# EAGLE design ESP-WROOM32-Breakout_v11 (EAGLE 7.7.0)
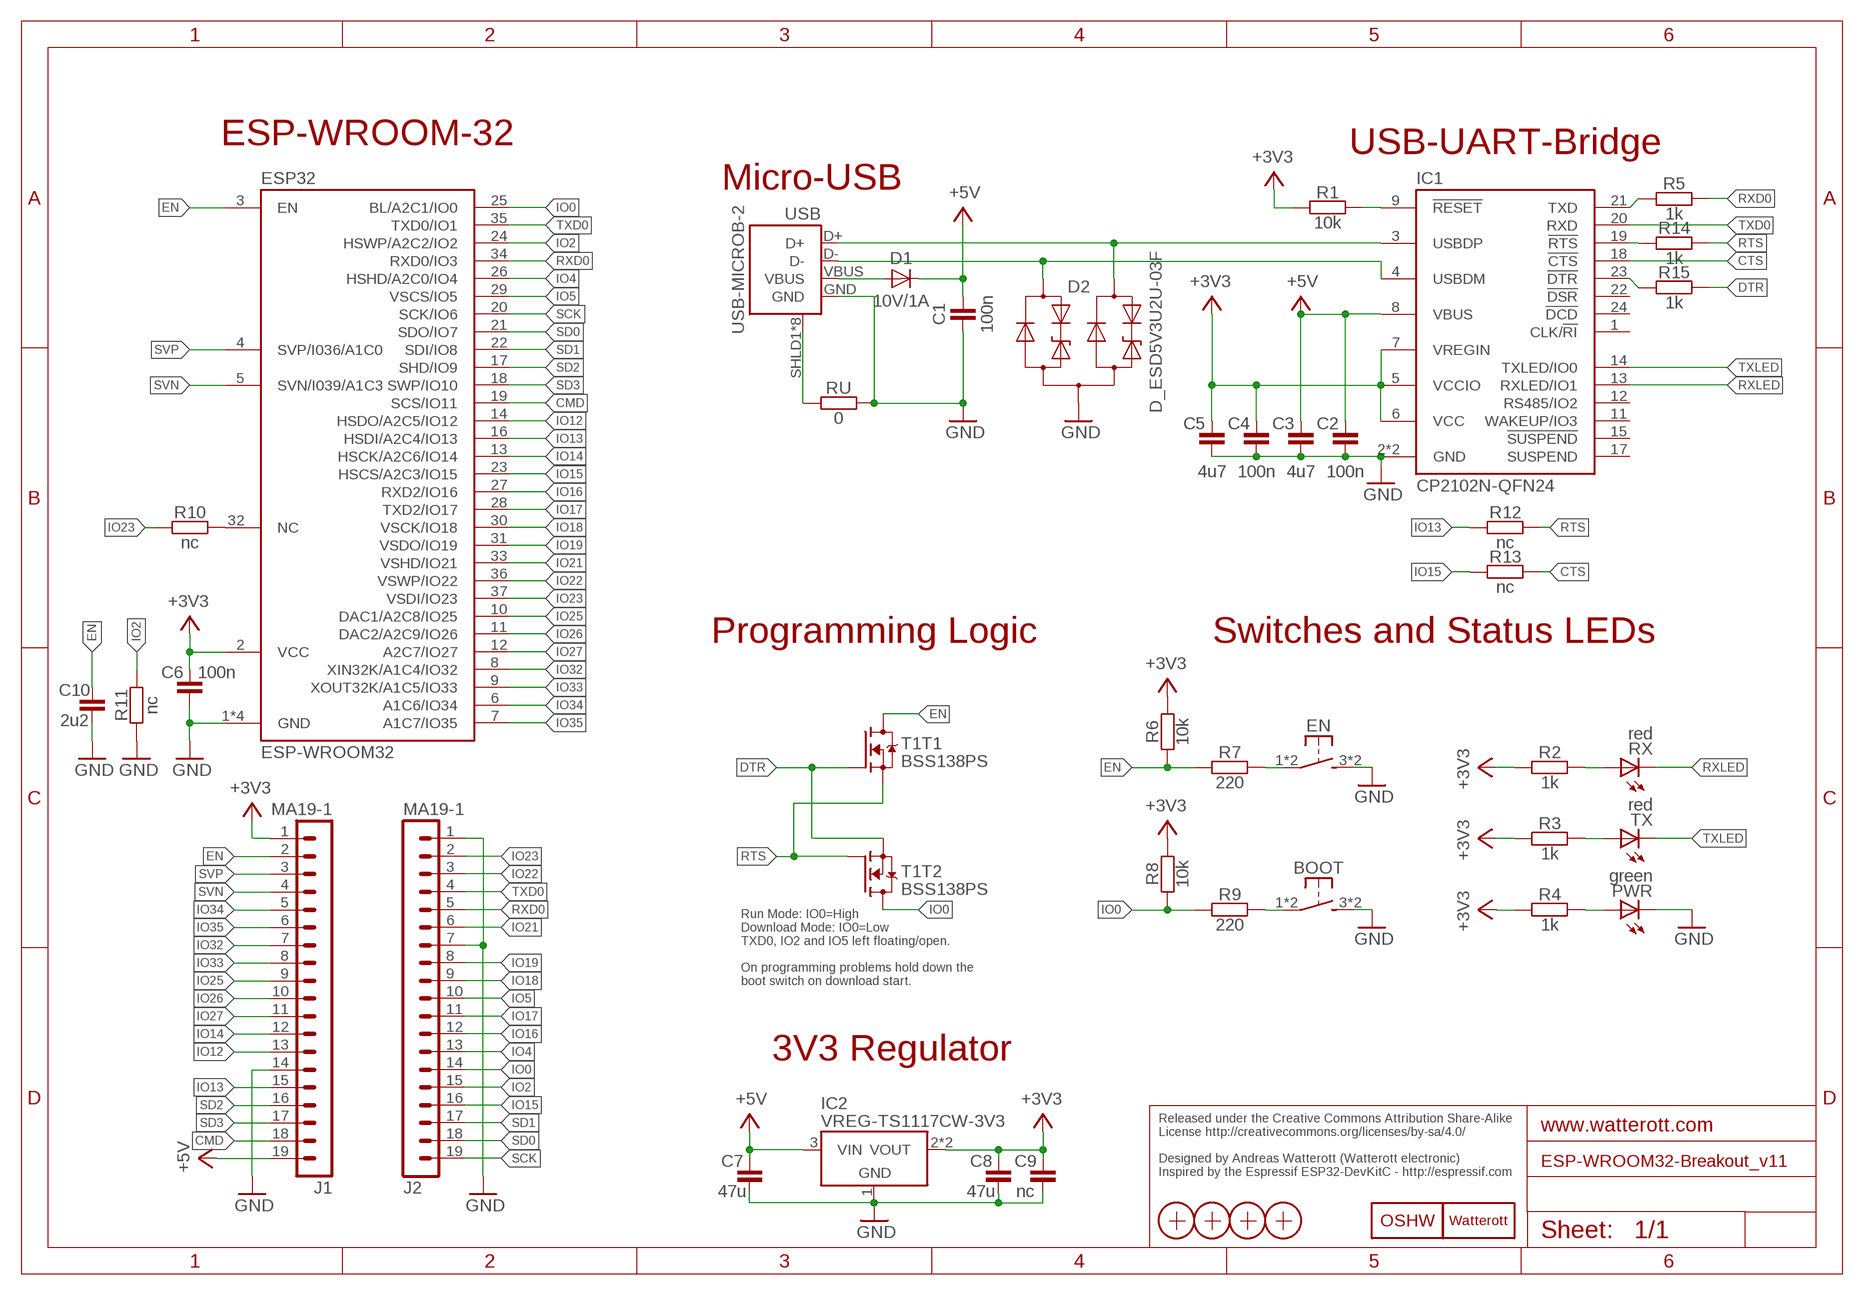
[diagram p0: schematic, sheet 1]

## Parts
BOOT  SW-TACTILE-PTS840P  [PTS840P]
C1  100n  CAPACITOR-0402  [C0402]
C2  100n  CAPACITOR-0402  [C0402]
C3  4u7  CAPACITOR-0603  [C0603]
C4  100n  CAPACITOR-0402  [C0402]
C5  4u7  CAPACITOR-0603  [C0603]
C6  100n  CAPACITOR-0402  [C0402]
C7  47u  CAPACITOR-1206  [C1206]
C8  47u  CAPACITOR-1206  [C1206]
C9  nc  CAPACITOR-1206  [C1206]
C10  2u2  CAPACITOR-0402  [C0402]
D1  10V/1A  DIODE-SMA  [SMA_DO214AC]
D2  D_ESD5V3U2U-03F  [SOT723]
EN  SW-TACTILE-PTS840P  [PTS840P]
ESP32  ESP-WROOM32  [ESP-WROOM32]
IC1  CP2102N-QFN24  [QFN24-PAD]
IC2  VREG-TS1117CW-3V3  [SOT223]
J1  MA19-1  [MA19-1]
J2  MA19-1  [MA19-1]
LOGO2  OSHW_LOGOX0070  [OSHW_6X70]
LOGO4  LOGO-S_PLACE_M  [SPARK_TPLACE_M]
PWR  green  LED-0603  [C0603]
R1  10k  RESISTOR-0402  [C0402]
R2  1k  RESISTOR-0402  [C0402]
R3  1k  RESISTOR-0402  [C0402]
R4  1k  RESISTOR-0402  [C0402]
R5  1k  RESISTOR-0402  [C0402]
R6  10k  RESISTOR-0402  [C0402]
R7  220  RESISTOR-0402  [C0402]
R8  10k  RESISTOR-0402  [C0402]
R9  220  RESISTOR-0402  [C0402]
R10  nc  RESISTOR-0402  [C0402]
R11  nc  RESISTOR-0402  [C0402]
R12  nc  RESISTOR-0402  [C0402]
R13  nc  RESISTOR-0402  [C0402]
R14  1k  RESISTOR-0402  [C0402]
R15  1k  RESISTOR-0402  [C0402]
RU  0  RESISTOR-0402  [C0402]
RX  red  LED-0603  [C0603]
T1  BSS138PS  [SOT363]
TX  red  LED-0603  [C0603]
USB  USB-MICROB-2  [USB-MICROB-10118194]
X1  PASSER-07  [PASSER_07MM]
X2  PASSER-07  [PASSER_07MM]
X3  PASSER-07  [PASSER_07MM]
X4  PASSER-07  [PASSER_07MM]

## Nets
+3V3: C4.2 C5.2 C6.2 C8.2 C9.2 ESP32.2(VCC) IC1.5(VCCIO) IC1.6(VCC) IC1.7(VREGIN) IC2.2(VOUT) IC2.4(VOUT) J1.1 R1.1 R2.1 R3.1 R4.1 R6.2 R8.2
+5V: C1.2 C2.2 C3.2 C7.2 D1.C IC1.8(VBUS) IC2.3(VIN) J1.19
CMD: ESP32.19(SCS/IO11) J1.18
CPDTR: IC1.23(!DTR) R15.1
CPRTS: IC1.19(!RTS) R14.1
CPTX: IC1.21(TXD) R5.1
CTS: IC1.18(!CTS) R13.2
D_N: D2.1(C1) IC1.4(USBDM) USB.D-
D_P: D2.2(C2) IC1.3(USBDP) USB.D+
DTR: R15.2 T1.2(T1:G) T1.4(T2:S)
EN: C10.2 ESP32.3(EN) J1.2 R6.1 R7.1 T1.6(T1:D)
GND: BOOT.3(S1) BOOT.4(S1) C1.1 C2.1 C3.1 C4.1 C5.1 C6.1 C7.1 C8.1 C9.1 C10.1 D2.3(A) EN.3(S1) EN.4(S1) ESP32.1(GND) ESP32.15(GND) ESP32.38(GND) ESP32.TP(GND) IC1.2(GND) IC1.TP(GND) IC2.1(GND) J1.14 J2.1 J2.7 PWR.C R11.1 RU.2 USB.GND
IO0: ESP32.25(BL/A2C1/IO0) J2.14 R8.1 R9.1 T1.3(T2:D)
IO2: ESP32.24(HSWP/A2C2/IO2) J2.15 R11.2
IO4: ESP32.26(HSHD/A2C0/IO4) J2.13
IO5: ESP32.29(VSCS/IO5) J2.10
IO12: ESP32.14(HSDO/A2C5/IO12) J1.13
IO13: ESP32.16(HSDI/A2C4/IO13) J1.15 R12.1
IO14: ESP32.13(HSCK/A2C6/IO14) J1.12
IO15: ESP32.23(HSCS/A2C3/IO15) J2.16 R13.1
IO16: ESP32.27(RXD2/IO16) J2.12
IO17: ESP32.28(TXD2/IO17) J2.11
IO18: ESP32.30(VSCK/IO18) J2.9
IO19: ESP32.31(VSDO/IO19) J2.8
IO21: ESP32.33(VSHD/IO21) J2.6
IO22: ESP32.36(VSWP/IO22) J2.3
IO23: ESP32.37(VSDI/IO23) J2.2 R10.1
IO25: ESP32.10(DAC1/A2C8/IO25) J1.9
IO26: ESP32.11(DAC2/A2C9/IO26) J1.10
IO27: ESP32.12(A2C7/IO27) J1.11
IO32: ESP32.8(XIN32K/A1C4/IO32) J1.7
IO33: ESP32.9(XOUT32K/A1C5/IO33) J1.8
IO34: ESP32.6(A1C6/IO34) J1.5
IO35: ESP32.7(A1C7/IO35) J1.6
N$1: EN.1 EN.2(P1) R7.2
N$2: BOOT.1 BOOT.2(P1) R9.2
NC: ESP32.32(NC) R10.2
PWR-LED: PWR.A R4.2
RESET: IC1.9(!RESET) R1.2
RTS: R12.2 R14.2 T1.1(T1:S) T1.5(T2:G)
RX-LED: R2.2 RX.A
RXD0: ESP32.34(RXD0/IO3) J2.5 R5.2
RXLED: IC1.13(RXLED/IO1) RX.C
SCK: ESP32.20(SCK/IO6) J2.19
SD0: ESP32.21(SDO/IO7) J2.18
SD1: ESP32.22(SDI/IO8) J2.17
SD2: ESP32.17(SHD/IO9) J1.16
SD3: ESP32.18(SWP/IO10) J1.17
SHLD: RU.1 USB.SHLD1(SHIELD) USB.SHLD2(SHIELD) USB.SHLD3(SHIELD) USB.SHLD4(SHIELD) USB.SHLD5(SHIELD) USB.SHLD6(SHIELD) USB.SHLD7(SHIELD) USB.SHLD8(SHIELD)
SVN: ESP32.5(SVN/I039/A1C3) J1.4
SVP: ESP32.4(SVP/I036/A1C0) J1.3
TX-LED: R3.2 TX.A
TXD0: ESP32.35(TXD0/IO1) IC1.20(RXD) J2.4
TXLED: IC1.14(TXLED/IO0) TX.C
VBUS: D1.A USB.VBUS
Unconnected: IC1.1(CLK/!RI) IC1.11(WAKEUP/IO3) IC1.12(RS485/IO2) IC1.15(!SUSPEND) IC1.17(SUSPEND) IC1.22(!DSR) IC1.24(!DCD)

## Notes on the sheet
- ESP-WROOM-32 | USB-UART-Bridge
- Micro-USB
- Programming Logic | Switches and Status LEDs
- Run Mode: IO0=High
  Download Mode: IO0=Low
  TXD0, IO2 and IO5 left floating/open.
  
  On programming problems hold down the 
  boot switch on download start.
- 3V3 Regulator
- Released under the Creative Commons Attribution Share-Alike
  License http://creativecommons.org/licenses/by-sa/4.0/
  
  Designed by Andreas Watterott (Watterott electronic)
  Inspired by the Espressif ESP32-DevKitC - http://espressif.com

## Library data of the parts
BOOT EN = we-switch:SW-TACTILE: Tactile Switches; DIGIKEY: CKN10511DKR-ND
C1-C10 = we-rcl:CAPACITOR: Capacitors ...2.2uF @ 6.3V -> 0402 ...4.7uF @ 6.3V -> 0603 ...10uF @ 16V -> 0805 ...22uF @ 25V -> 1206
D1 = we-rcl:DIODE: Diodes
D2 = we-rcl:D_ESD5V3U2U: TVS Diode - Uni-directional Ultra Low ESD / Transient Protection Diode Vrwm=5.3V, 0.4pF@1MHz; DIGIKEY: ESD5V3U2U-03F H6327DKR-ND
ESP32 = we-chip:ESP-WROOM32: Espressif ESP-WROOM-32 ESP32 WiFi/WLAN + Bluetooth/BLE Module Compatible with AI-Thinker ESP-32S Module.
IC1 = we-chip:CP2102N: Silabs CP2102N USB to UART Bridge (5V tolerant inputs) CP2102N-QFN24 is pin-compatible with CP2104.
IC2 = we-power:VREG: Voltage Regulators (LDOs, Switching Converters...) LDOs Taiwan Semi TS1117 800mA max 15V - compatible On Semi NCP1117 1A max 20V Taiwan Semi TS9011 250mA max 12V - compatible Diodes AP2210 300mA max 15V - compatible Microchip MCP1702 250mA max 13V - compatible Microchip MCP1703 250mA max 16V - compatible Microchip MCP1754 150mA max 16V Taiwan Semi TS5204 150mA max 16V (low noise) DC/DC Converter Modules Recom R-78Ex.x-1.0-W36 1A max 28V Murata OKI-78SR-x.x/1.5-W36 1.5A max 36V CUI V78xx-2000 2A max 18V
J1 J2 = we-con:MA19-1: Pin Header
LOGO2 = we-symbol:OSHW_LOGO: Open-Source-Hardware Logo
LOGO4 = we-symbol:LOGO: Watterott electronic Logo
PWR RX TX = we-opto:LED: LEDs red, green, blue -> 0603
R1-R15 RU = we-rcl:RESISTOR: Resistors all kinds in 0402 and 0603
T1 = we-transistor:BSS138PS: Dual N-Channel MOSFET BSS138 (Vgs>=+/-20V, Vds>=40V, Id>=0.2A + Rds<=3Ohm @ Vgs=4.5V)
USB = we-con:USB: USB Connectors; DIGIKEY: 609-4618-6-ND
X1-X4 = we-symbol:PASSER: Fiducial Markers

## Board
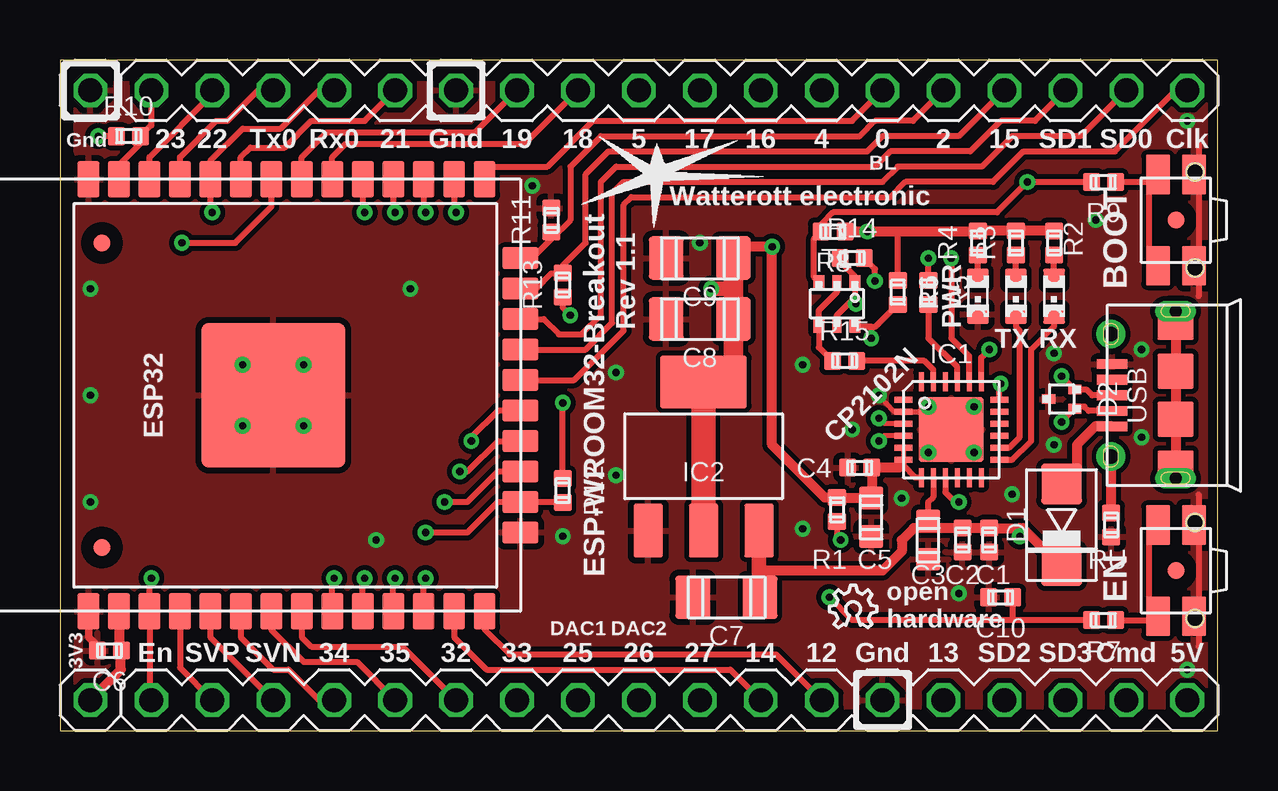
[diagram p1: board, top side]
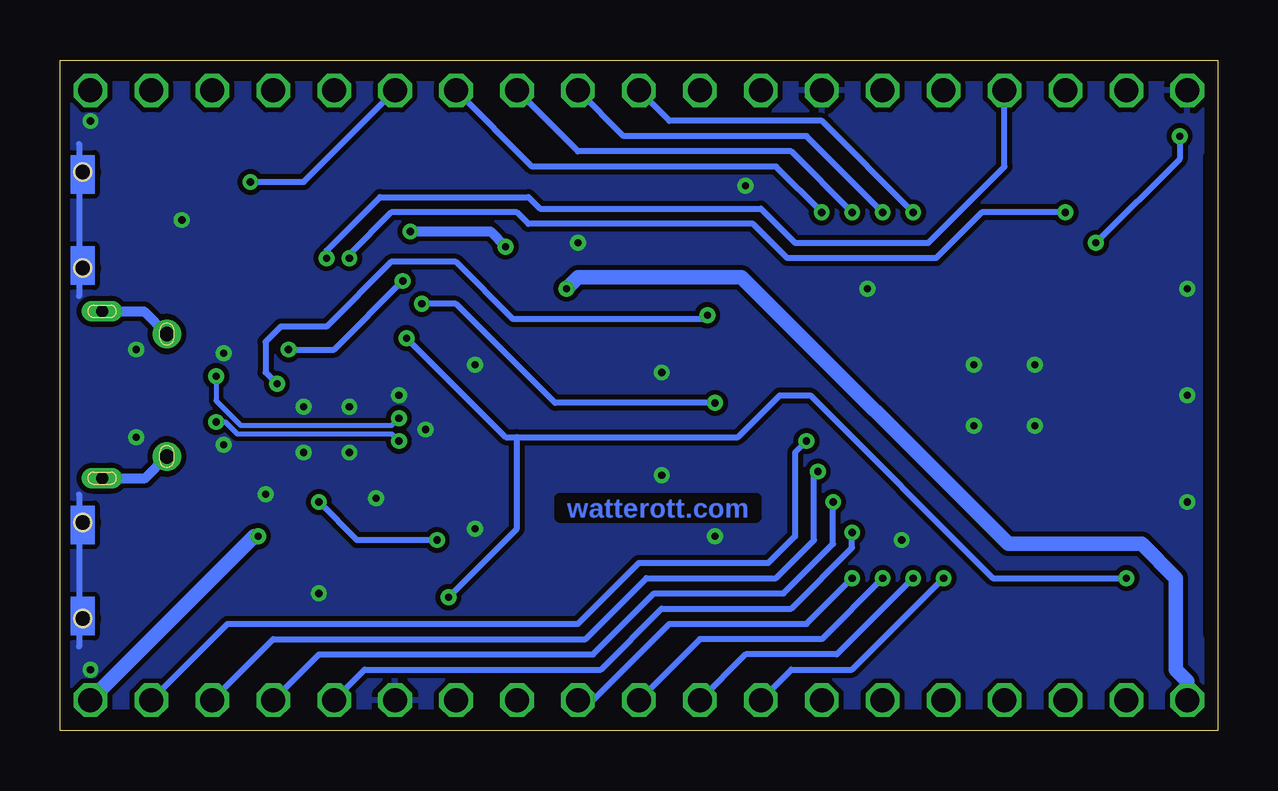
[diagram p2: board, bottom side, seen from below]

Size 48.26 x 27.94 mm. Coordinates in mm from the lower left corner, seen from the top.
Outline: 0,0 48.26,0 48.26,27.94 0,27.94 0,0
Copper layers (1*16): Top 0.035mm / dielectric 1.5mm / Bottom 0.035mm
Design rules "we-dru-2-layer *": minimum track width 0.15mm, minimum drill 0.3mm, track to track 0.15mm, track to pad 0.15mm, pad to pad 0.15mm, via to via 0.15mm, smd to smd 0.1mm, copper to edge 0.4mm, drill to drill 0.2mm, minimum pad ring 0.18mm, minimum via ring 0.18mm, stop-mask expansion 0.1mm, vias tented up to drill 0.5mm, thermal gap 0.25mm

### Footprints (pad centres in the part's own frame; a part is rotated, then mirrored left to right if it is on the bottom)
PTS840P = smd 1.65 x 1: 1 -1.9,0.75; 2 1.9,0.75; 3 -1.9,-0.75; 4 1.9,-0.75 | hole 0.7: -2,-0.8; 2,-0.8
C0402 = smd 0.75 x 0.7: 1 0,0.5; 2 0,-0.5
C0603 = smd 1 x 0.95: 1 0,0.8; 2 0,-0.8
C1206 = smd 1.8 x 1.45: 1 0,1.4; 2 0,-1.4
SMA_DO214AC = smd 1.7 x 1.7: A 0,-1.7; C 0,1.7
SOT723 = smd 0.6 x 0.4: 1 -0.55,0.4; 2 -0.55,-0.4; 3 0.55,0
ESP-WROOM32 = smd 1.5 x 0.9: 1 -9,7; 2 -9,5.73; 3 -9,4.46; 4 -9,3.19; 5 -9,1.92; 6 -9,0.65; 7 -9,-0.62; 8 -9,-1.89; 9 -9,-3.16; 10 -9,-4.43; 11 -9,-5.7; 12 -9,-6.97; 13 -9,-8.24; 14 -9,-9.51; 25 9,-9.51; 26 9,-8.24; 27 9,-6.97; 28 9,-5.7; 29 9,-4.43; 30 9,-3.16; 31 9,-1.89; 32 9,-0.62; 33 9,0.65; 34 9,1.92; 35 9,3.19; 36 9,4.46; 37 9,5.73; 38 9,7 | smd 0.9 x 1.5: 15 -5.715,-11; 16 -4.445,-11; 17 -3.175,-11; 18 -1.905,-11; 19 -0.635,-11; 20 0.635,-11; 21 1.905,-11; 22 3.175,-11; 23 4.445,-11; 24 5.715,-11 | smd 6 x 6: TP 0,-0.7
QFN24-PAD = smd 0.8 x 0.26: 1 -2,1.25; 2 -2,0.75; 3 -2,0.25; 4 -2,-0.25; 5 -2,-0.75; 6 -2,-1.25; 13 2,-1.25; 14 2,-0.75; 15 2,-0.25; 16 2,0.25; 17 2,0.75; 18 2,1.25 | smd 0.26 x 0.8: 7 -1.25,-2; 8 -0.75,-2; 9 -0.25,-2; 10 0.25,-2; 11 0.75,-2; 12 1.25,-2; 19 1.25,2; 20 0.75,2; 21 0.25,2; 22 -0.25,2; 23 -0.75,2; 24 -1.25,2 | smd 2.7 x 2.7: TP 0,0
SOT223 = smd 2.235 x 1.219: 1 -3.099,2.311; 2 -3.099,0; 3 -3.099,-2.311 | smd 2.2 x 3.6: 4 3.099,0
MA19-1 = drill 1 octagon: 1 0,22.86; 2 0,20.32; 3 0,17.78; 4 0,15.24; 5 0,12.7; 6 0,10.16; 7 0,7.62; 8 0,5.08; 9 0,2.54; 10 0,0; 11 0,-2.54; 12 0,-5.08; 13 0,-7.62; 14 0,-10.16; 15 0,-12.7; 16 0,-15.24; 17 0,-17.78; 18 0,-20.32; 19 0,-22.86
C0603' = smd 0.9 x 0.8: A 0,-0.75; C 0,0.75
SOT363 = smd 0.6 x 0.5: 1 -0.9,0.75; 3 -0.9,-0.75; 4 0.9,-0.75; 6 0.9,0.75 | smd 0.6 x 0.4: 2 -0.9,0; 5 0.9,0
USB-MICROB-10118194 = smd 1.3 x 0.4: D+ -2.5,0; D- -2.5,-0.65; GND -2.5,1.3; ID -2.5,0.65; VBUS -2.5,-1.3 | drill 0.6 pad 1.2: SHLD1 -2.55,2.55; SHLD2 -2.55,-2.55 | drill 0.5 pad 0.8 long: SHLD3 0.15,3.5; SHLD4 0.15,-3.45 | smd 1.5 x 1.1: SHLD5 0.15,2.85; SHLD6 0.15,-2.85 | smd 1.5 x 1.5: SHLD7 0.15,1; SHLD8 0.15,-1
PASSER_07MM = smd 0.7 x 0.7: X 0,0

### Placement (x,y rotation side)
BOOT  46.51,21.27 90 top
C1  38.73,7.94 180 top
C2  37.62,7.94 180 top
C3  36.2,7.94 180 top
C4  33.34,10.95 90 top
C5  33.81,8.89 180 top
C6  2.06,3.33 90 top
C7  27.78,5.56 90 top
C8  26.67,17.14 90 top
C9  26.67,19.68 90 top
C10  39.21,5.56 90 top
D1  41.75,8.57 180 top
D2  41.75,13.81 180 top
EN  46.51,6.67 90 top
ESP32  8.19,13.97 90 top
IC1  37.15,12.54 0 top
IC2  26.83,11.43 90 top
J1  24.13,1.27 90 top
J2  24.13,26.67 90 top
LOGO2  32.07,4.29 0 top
LOGO4  24.92,23.18 0 top
PWR  green  [C0603']  38.26,18.1 180 top
R1  32.38,9.21 0 top
R2  41.43,20.32 0 top
R3  39.85,20.32 0 top
R4  38.26,20.32 0 top
R5  36.2,18.26 180 top
R6  34.92,18.26 180 top
R7  43.5,4.6 90 top
R8  32.23,20.8 90 top
R9  43.5,22.86 90 top
R10  2.86,24.77 270 top
R11  20.48,21.27 0 top
R12  20.95,10 180 top
R13  20.95,18.57 0 top
R14  33.02,19.68 270 top
R15  32.7,15.4 270 top
RU  43.81,8.57 0 top
RX  red  [C0603']  41.43,18.1 180 top
T1  32.38,17.78 270 top
TX  red  [C0603']  39.85,18.1 180 top
USB  46.35,13.97 0 top
X1  1.75,20.32 180 top
X2  1.75,7.62 180 top
X3  46.51,21.27 0 top
X4  46.51,6.67 0 top

### Tracks (layer width: path | path; a pad name or v marks a point on that pad's centre or on a via)
+3V3  (via drill 0.3)
  Top 0.203: 33.84,9.71 C5.2 33.8,9.71 | IC1.5 IC1.6
  Top 0.254: 34.95,11.29 IC1.6 35.15,11.11 | IC1.7 35.66,10.54 35.15,11.05 35.15,11.11 | 34.99,10.95 35.15,11.11 | C9.2 28.07,19.71 27.94,19.84 | R6.2 34.92,20.8
  Top 0.406: R2.1 R3.1 R4.1 38.23,20.8 34.92,20.8 v33.66,20.8 R8.2 | 34.99,10.95 C4.2 33.84,9.71 | 33.8,9.71 R1.1 31.89,9.71 29.69,11.91 v29.69,20.16 28.26,20.16 27.94,19.84 | ESP32.2 2.46,3.44 C6.2 2.54,3.31 2.54,2.54 J1.1
  Top 0.61: 28.07,14.89 27.78,14.61 26.91,14.61 IC2.4 | v27.15,18.41 28.07,18.41
  Top 0.813: C9.2 28.07,18.41 C8.2 28.07,14.89
  Top 1.016: IC2.2 IC2.4
  Bottom 0.406: v33.66,20.8 30.32,20.8 v29.69,20.16
  Bottom 0.61: v27.15,18.41 26.67,18.89 19.84,18.89 8.73,7.78 3.17,7.78 1.75,6.35 1.75,2.54 1.27,2.06 J1.1
+5V  (via drill 0.3)
  Top 0.254: D1.C 41.7,6.87 | IC1.8 36.4,9.73 36.2,9.53 C3.2
  Top 0.406: 40.01,8.44 C1.2 C2.2 36.2,8.44 | 40.01,8.44 40.14,8.44 41.7,6.87 | v40.01,8.1 40.01,8.44 | 29.14,6.67 34.29,6.67 35.08,7.46 35.08,7.94 35.58,8.44 36.2,8.44 | C3.2 36.2,8.44
  Top 0.61: IC2.3 29.14,6.67 29.14,5.6 C7.2
  Bottom 0.61: J1.19 40.16,8.1 v40.01,8.1
CMD  (via drill 0.3)
  Top 0.254: ESP32.19 18.26,13.34 17.14,12.22 v17.14,12.06
  Bottom 0.254: J1.18 41.27,4.45 26.67,4.45 24.13,6.99 18.73,6.99 17.62,8.1 17.62,11.59 v17.14,12.06
CPDTR
  Top 0.254: IC1.23 36.4,15.04 36.04,15.4 R15.1
CPRTS  (via drill 0.3)
  Top 0.254: 33.52,19.5 R14.1 33.97,19.23 v33.97,18.73 | IC1.19 38.4,15.54 v38.73,15.88
  Bottom 0.254: v38.73,15.88 36.83,15.88 v33.97,18.73
CPTX
  Top 0.254: IC1.21 37.4,15.15 36.2,16.35 R5.1
CTS  (via drill 0.3)
  Top 0.254: R13.2 20.95,17.62 v21.27,17.3 | IC1.18 39.15,14.38 v39.21,14.45
  Bottom 0.254: v39.21,14.45 39.69,14.92 39.69,16.19 39.05,16.83 37.15,16.83 34.45,19.53 31.75,19.53 29.37,17.14 21.43,17.14 v21.27,17.3
D_N  (via drill 0.3)
  Top 0.15: 42.38,13.49 D2.1
  Top 0.16: D2.1
  Top 0.203: IC1.4 34.36,12.29 v34.13,12.06 | D2.1 | D2.1 v41.75,12.86
  Top 0.254: USB.D- 42.88,13.32 42.7,13.49 42.38,13.49
  Bottom 0.203: v41.75,12.86 41.37,12.86 40.87,12.37 34.43,12.37 v34.13,12.06
D_P  (via drill 0.3)
  Top 0.203: IC1.3 34.36,12.79 v34.13,13.02 | D2.2 v41.75,14.76
  Top 0.254: USB.D+ 43.02,13.97 42.78,14.21 D2.2
  Bottom 0.203: v41.75,14.76 41.75,13.74 40.73,12.72 34.43,12.72 v34.13,13.02
DTR
  Top 0.254: T1.2 32.38,18.26 31.64,17.51 T1.4 31.64,15.97 R15.2 32.23,15.4
EN  (via drill 0.3)
  Top 0.254: J1.2 3.73,1.35 ESP32.3 3.73,6.27 v3.81,6.35 | R7.1 39.69,4.6 | 39.69,4.6 33.02,4.6 v32.07,5.56 | v33.81,16.35 33.81,16.83 | 33.81,16.83 33.19,16.83 | 33.81,16.83 34,16.83 R6.1 | C10.2 39.69,5.56 39.69,4.6
  Top 0.406: 33.19,16.83 T1.6
  Bottom 0.254: v3.81,6.35 9.37,6.35 16.99,13.97 18.26,13.97 20,12.22 29.21,12.22 | v32.07,5.56 29.21,8.41 29.21,12.22 | v33.81,16.35 29.69,12.22 29.21,12.22
GND  (via drill 0.3)
  Top 0.203: IC1.TP 36.4,13.29 IC1.2 34.78,13.29 34.42,13.65
  Top 0.254: 47.47,24.45 47.47,19.37 | 47.47,19.37 47.47,18.1 | 47.47,9.84 47.47,4.76 | 47.47,4.76 47.47,3.49 | EN.3 47.46,4.77 47.47,4.76 | BOOT.3 47.46,19.37 47.47,19.37
  Top 0.305: C6.1 1.56,3.52 1.19,3.89 ESP32.1
  Bottom 0.254: 47.47,9.84 47.47,3.49 | 47.47,24.45 47.47,18.1
  other vias: 35.08,9.68 38.1,11.59 36.2,11.59 38.1,13.49 36.2,13.49 34.13,13.97 41.43,11.91 41.43,15.72 1.27,18.41 1.27,9.53 1.27,13.97 45.09,15.88 45.09,12.22 43.18,21.27 33.02,12.54 7.62,12.7 10.16,12.7 7.62,15.24 10.16,15.24 23.18,10.64 23.18,14.92 37.47,5.71 46.99,25.4 30.96,15.24 13.18,7.94 19.68,22.7 39.69,9.84 14.61,18.41 20.95,8.1 46.99,2.54 30.96,8.41 26.67,20.32
  pour Top (isolate 0.203, rank 2): 0.64,26.99 48.1,26.99 48.1,0.95 0.64,0.95
  pour Bottom (isolate 0.203): 0.64,26.99 48.1,26.99 48.1,0.95 0.64,0.95
IO0  (via drill 0.3)
  Top 0.254: ESP32.25 17.7,23.41 17.78,23.5 20.32,23.5 22.23,25.4 33.02,25.4 J2.14 | R9.1 v40.32,22.86 39.05,21.59 32.23,21.59 31.75,21.11 31.75,20.82 R8.1 31.43,20.5 31.43,18.89 T1.3
  Bottom 0.254: v40.32,22.86 38.1,22.86 J2.14
IO2
  Top 0.254: J2.15 35.56,25.4 33.97,25.4 33.34,24.77 22.54,24.77 21.27,23.5 21.27,21.27 20.48,20.48 | ESP32.24 19.68,19.68 20.48,20.48 | 20.48,20.48 R11.2
IO4  (via drill 0.3)
  Top 0.254: ESP32.26 16.43,21.67 v16.51,21.59
  Bottom 0.254: v16.51,21.59 18.41,23.5 28.57,23.5 J2.13
IO5  (via drill 0.3)
  Top 0.254: ESP32.29 12.62,21.67 v12.7,21.59
  Bottom 0.254: v12.7,21.59 16.51,25.4 22.86,25.4 J2.10
IO12
  Top 0.254: J1.13 29.84,3.17 18.73,3.17 17.7,4.21 ESP32.14
IO13  (via drill 0.3)
  Top 0.254: v15.24,8.26 16.99,8.26 18.26,9.53 ESP32.16 20.93,9.53 R12.1
  Bottom 0.254: J1.15 35.56,2.54 25.72,2.54 23.18,5.08 17.78,5.08 15.24,7.62 v15.24,8.26
IO14
  Top 0.254: ESP32.13 16.43,3.89 17.78,2.54 27.94,2.54 J1.12
IO15
  Top 0.254: J2.16 37.47,24.77 34.29,24.77 33.66,24.13 22.86,24.13 21.91,23.18 21.91,20.32 20.95,19.37 R13.1 20.93,19.05 20.48,19.05 19.84,18.41 ESP32.23
IO16  (via drill 0.3)
  Top 0.254: ESP32.27 15.16,21.67 v15.24,21.59
  Bottom 0.254: v15.24,21.59 17.78,24.13 26.67,24.13 J2.12
IO17  (via drill 0.3)
  Top 0.254: ESP32.28 13.89,21.67 v13.97,21.59
  Bottom 0.254: v13.97,21.59 17.14,24.77 24.77,24.77 J2.11
IO18
  Top 0.254: ESP32.30 11.35,23.89 11.91,24.45 19.37,24.45 J2.9
IO19
  Top 0.254: ESP32.31 10.08,23.89 11.11,24.92 17.3,24.92 J2.8
IO21
  Top 0.254: ESP32.33 7.54,23.89 7.94,24.29 9.37,24.29 10.48,25.4 12.7,25.4 J2.6
IO22
  Top 0.254: ESP32.36 3.73,23.89 6.35,26.51 J2.3
IO23
  Top 0.254: ESP32.37 2.46,23.57 3.33,24.45 3.33,24.74 R10.1 3.81,25.22 J2.2
IO25  (via drill 0.3)
  Top 0.254: ESP32.10 12.62,6.27 v12.7,6.35
  Bottom 0.254: v12.7,6.35 15.88,3.17 19.68,3.17 J1.9
IO26  (via drill 0.3)
  Top 0.254: ESP32.11 13.89,6.27 v13.97,6.35
  Bottom 0.254: v13.97,6.35 16.51,3.81 21.59,3.81 J1.10
IO27  (via drill 0.3)
  Top 0.254: ESP32.12 15.16,6.27 v15.24,6.35
  Bottom 0.254: v15.24,6.35 17.14,4.45 22.86,4.45 26.04,1.27 J1.11
IO32
  Top 0.254: ESP32.8 10.08,3.89 10.48,3.49 14.29,3.49 J1.7
IO33  (via drill 0.3)
  Top 0.254: ESP32.9 11.35,6.27 v11.43,6.35
  Bottom 0.254: J1.8 17.78,2.54 15.24,2.54 v11.43,6.35
IO34
  Top 0.254: ESP32.6 7.54,3.89 8.89,2.54 9.53,2.54 10.79,1.27 J1.5
IO35
  Top 0.254: ESP32.7 8.81,4.21 10.16,2.86 12.38,2.86 J1.6
N$1
  Top 0.254: EN.2 45.4,8.21 45.4,5.24 45.76,4.88 EN.1 45.6,4.6 R7.2
N$2
  Top 0.254: BOOT.1 45.76,19.48 45.4,19.84 45.4,22.81 | 45.4,22.81 BOOT.2 | R9.2 45.35,22.86 45.4,22.81
NC  (via drill 0.3)
  Top 0.254: R10.2 v1.59,24.77 | v5.08,20.32 7.3,20.32 8.81,21.83 ESP32.32
  Bottom 0.254: v1.59,24.77 1.59,23.81 v5.08,20.32
PWR-LED
  Top 0.254: PWR.A R4.2
RESET  (via drill 0.3)
  Top 0.254: R1.2 32.38,8.1 v32.54,7.94 | IC1.9 36.9,9.93 37.31,9.53 v37.47,9.53
  Bottom 0.254: v32.54,7.94 35.88,7.94 v37.47,9.53
RTS  (via drill 0.3)
  Top 0.254: T1.5 32.38,17.3 32.86,17.78 | 32.86,17.78 33.13,18.05 T1.1 33.13,18.93 32.38,19.68 R14.2 | R12.2 v20.95,13.65 | v33.18,17.78 32.86,17.78
  Bottom 0.254: v20.95,13.65 27.62,13.65 31.75,17.78 v33.18,17.78
RX-LED
  Top 0.254: RX.A R2.2
RXD0  (via drill 0.3)
  Top 0.254: v6.35,21.59 6.27,21.67 ESP32.34 6.27,23.73 7.62,25.08 9.21,25.08 10.79,26.67 J2.5 | R5.2 v36.2,19.68
  Bottom 0.254: v6.35,21.59 9.84,21.59 11.75,19.68 17.94,19.68 19.37,21.11 28.73,21.11 29.21,21.59 34.45,21.59 36.2,19.84 v36.2,19.68
RXLED
  Top 0.254: IC1.13 39.71,11.29 40.48,12.06 40.48,15.88 41.43,16.83 RX.C
SCK
  Top 0.254: J2.19 46.51,26.67 43.97,24.13 40.16,24.13 38.89,22.86 35.24,22.86 34.61,22.23 23.81,22.23 23.5,21.91 23.5,16.67 21.43,14.61 ESP32.20
SD0
  Top 0.254: J2.18 42.55,24.77 39.69,24.77 38.42,23.5 34.92,23.5 34.29,22.86 23.5,22.86 23.02,22.38 23.02,16.99 21.91,15.88 ESP32.21
SD1
  Top 0.254: J2.17 40.64,25.4 39.21,25.4 37.94,24.13 34.61,24.13 33.97,23.5 23.18,23.5 22.54,22.86 22.54,17.3 21.75,16.51 20.8,16.51 20.16,17.14 ESP32.22
SD2  (via drill 0.3)
  Top 0.254: v16.03,9.53 16.99,9.53 18.26,10.79 ESP32.17
  Bottom 0.254: J1.16 37.47,3.17 26.04,3.17 23.5,5.71 18.1,5.71 16.03,7.78 v16.03,9.53
SD3  (via drill 0.3)
  Top 0.254: v16.67,10.79 16.99,10.79 18.26,12.06 ESP32.18
  Bottom 0.254: J1.17 39.37,3.81 26.35,3.81 23.81,6.35 18.41,6.35 16.83,7.94 16.83,10.64 v16.67,10.79
SHLD
  Top 0.406: USB.SHLD3 USB.SHLD5 USB.SHLD7 USB.SHLD8 USB.SHLD6 USB.SHLD4 | RU.1 43.81,11.41 USB.SHLD2
  Bottom 0.406: USB.SHLD4 44.7,10.52 USB.SHLD2 | USB.SHLD3 44.76,17.47 USB.SHLD1
SVN
  Top 0.254: ESP32.5 6.27,3.89 J1.4
SVP
  Top 0.254: ESP32.4 5,2.62 J1.3
TX-LED
  Top 0.254: TX.A R3.2
TXD0  (via drill 0.3)
  Top 0.254: ESP32.35 5,23.89 6.51,25.4 6.99,25.4 8.26,26.67 J2.4 | IC1.20 37.9,15.6 37.15,16.35 v37.15,19.68
  Bottom 0.254: v37.15,19.68 37.15,20 34.92,22.23 28.73,22.23 28.26,21.75 19.05,21.75 17.62,20.32 12.06,20.32 8.89,23.5 J2.4
TXLED
  Top 0.254: IC1.14 39.57,11.79 40.01,12.22 40.01,16.67 39.85,16.83 TX.C
VBUS
  Top 0.406: USB.VBUS 43.15,12.67 42.39,11.91 42.39,10.91 D1.A

### Text on the board
Bottom: watterott.com
tPlace: Gnd | 23 | 22 | Tx0 | Rx0 | 21 | Gnd | 19 | 18 | 5 | 17 | 16 | 4 | 0 | 2 | 15 | SD1 | SD0 | Clk | BL | Watterott electronic | Rev 1.1 | ESP-WROOM32-Breakout | CP2102N | open / hardware | DAC1 | DAC2 | 3V3 | En | SVP | SVN | 34 | 35 | 32 | 33 | 25 | 26 | 27 | 14 | 12 | Gnd | 13 | SD2 | SD3 | Cmd | 5V
Reference: Silkscreen: 21 tPlace